# EAGLE design 05-PWR (EAGLE 9.6.2)
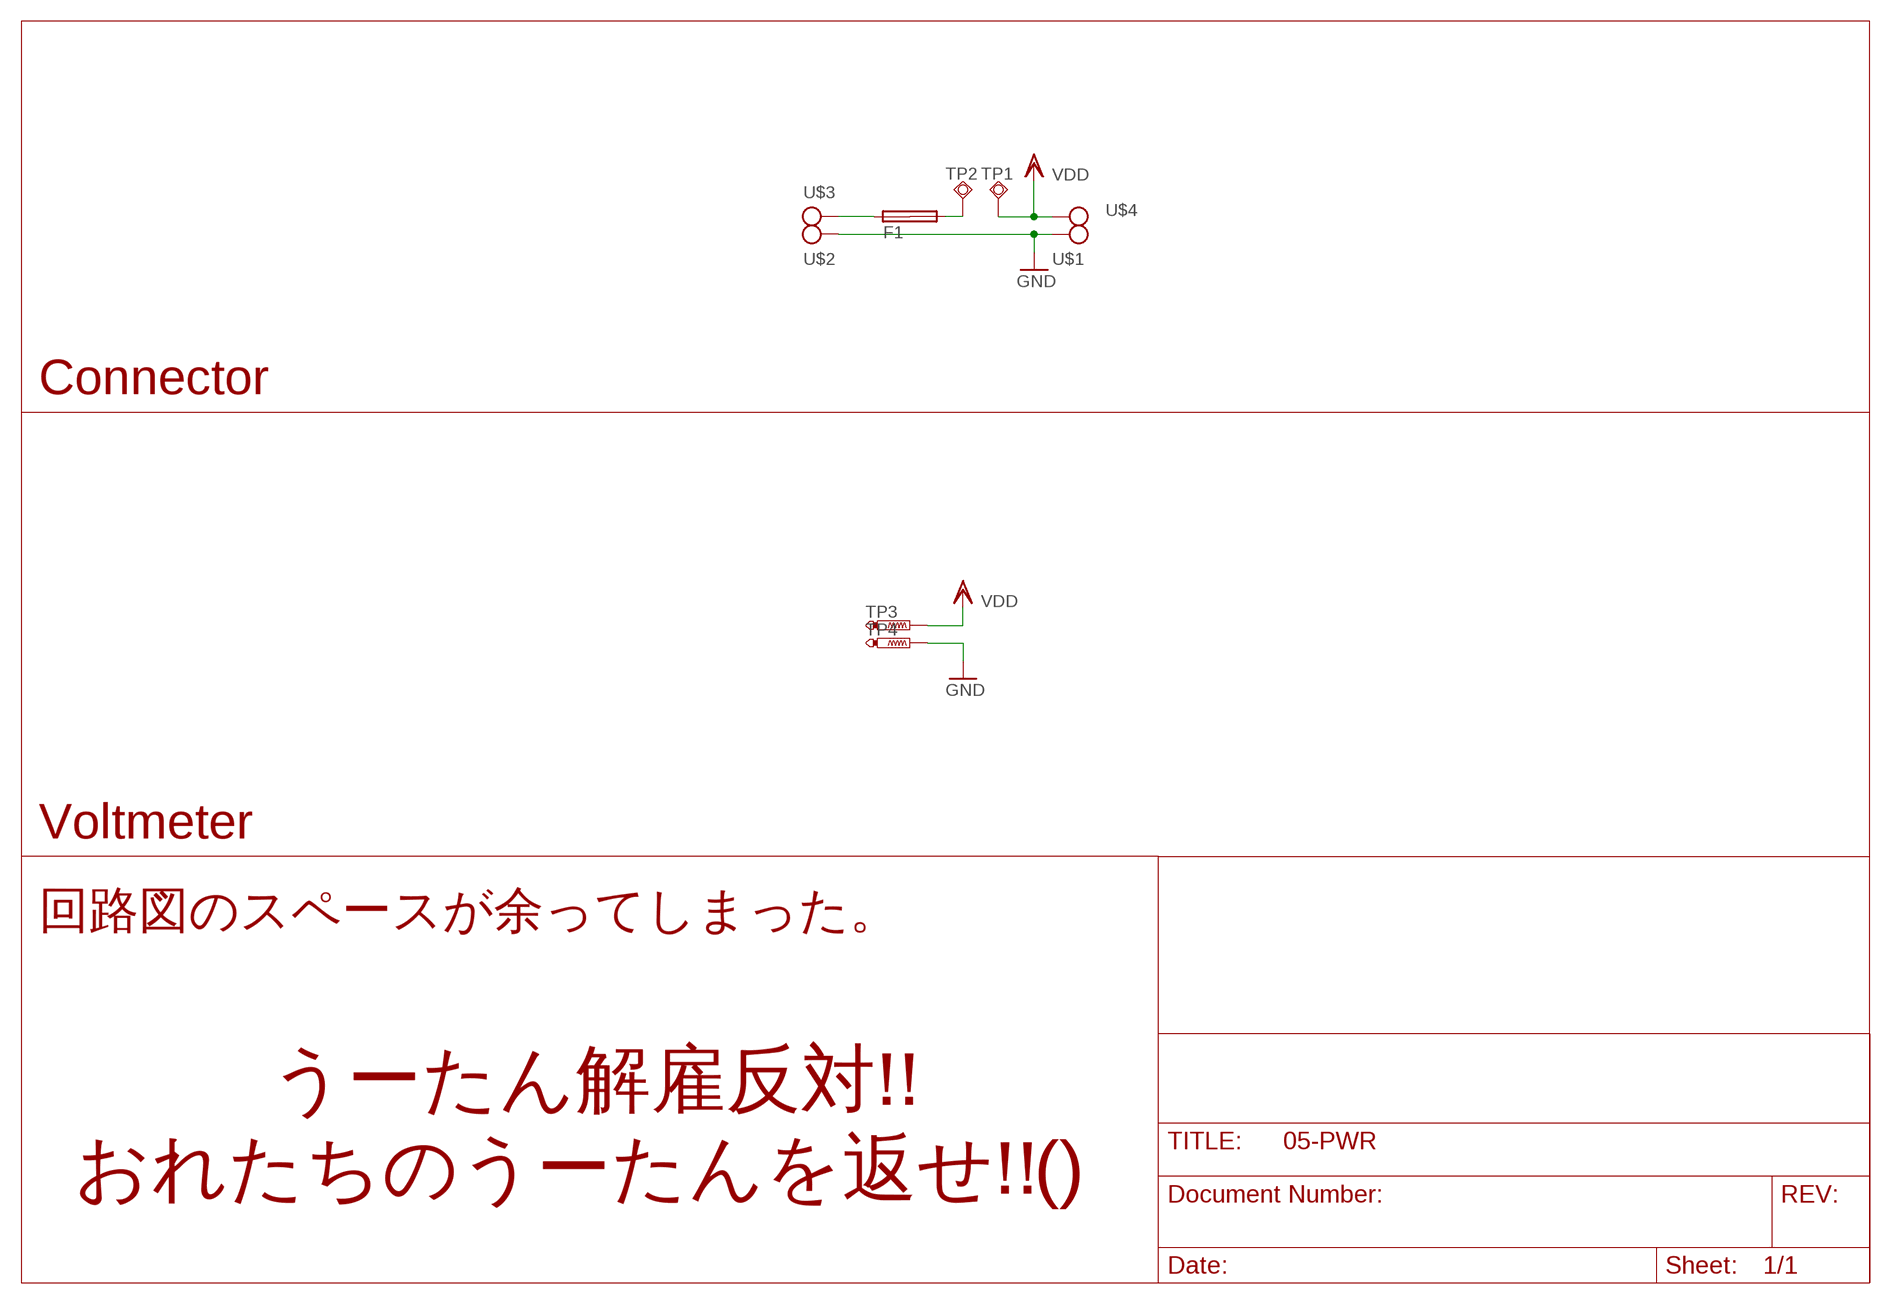
[diagram p0: schematic, sheet 1]

## Parts
F1  SHK20L  [SHK20L]
TP1  TPSQPAD1-20  [P1-20]
TP2  TPSQPAD1-20  [P1-20]
TP3  PTR1TP15R  [TP15R]
TP4  PTR1TP15SQ  [TP15SQ]
U$1  PAD_VDD  [VDD]
U$2  PAD_VDD  [VDD]
U$3  PAD_VDD  [VDD]
U$4  PAD_VDD  [VDD]

## Nets
GND: TP4.TP U$1.P$1(TP) U$2.P$1(TP)
N$2: F1.1A U$3.P$1(TP)
N$3: F1.2A TP2.TP
VDD: TP1.TP TP3.TP U$4.P$1(TP)
Unconnected: F1.1B F1.2B

## Notes on the sheet
- Connector
- Voltmeter
- 回路図のスペースが余ってしまった。
- うーたん解雇反対!!
- おれたちのうーたんを返せ!! | ()

## Library data of the parts
F1 = fuse:SHK20L: FUSE HOLDER 5 x 20 mm, SH contact, SHH1 Schukat, E1073 Buerklin; OC_FARNELL: unknown; OC_NEWARK: unknown
TP1 TP2 = testpad:TPSQ: Test pad
TP3 TP4 = testpad:PTR1: TEST PIN
U$1-U$4 = M2-CONN:PAD_VDD

## Net classes
0 default: width 0.406 mm

## Board
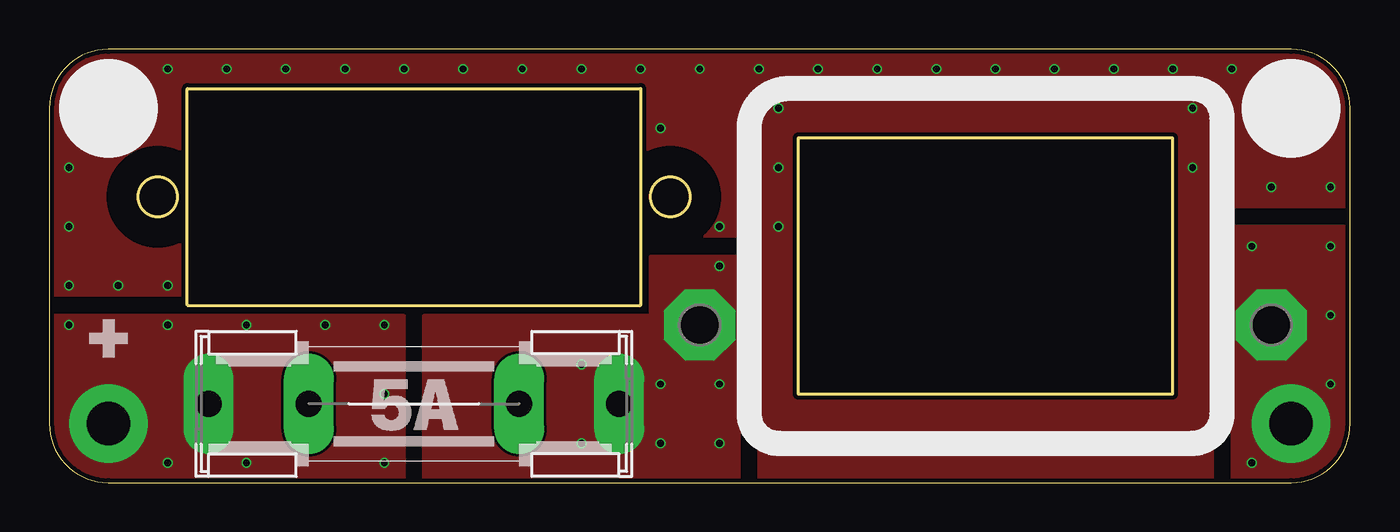
[diagram p1: board, top side]
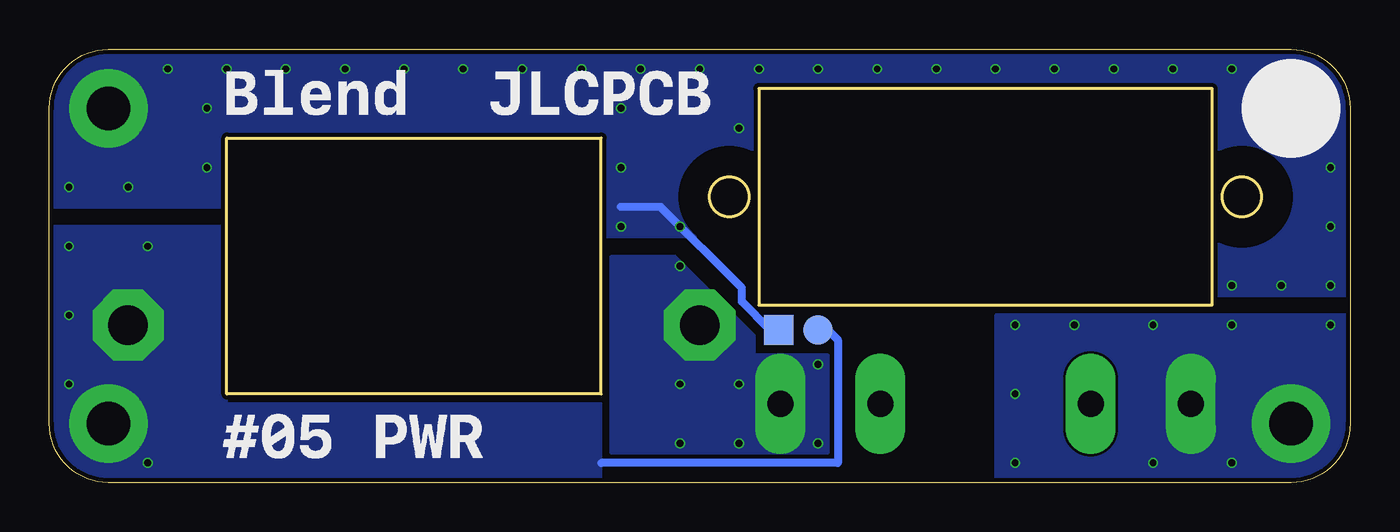
[diagram p2: board, bottom side, seen from below]

Size 66 x 22 mm. Coordinates in mm from the lower left corner, seen from the top.
Outline: 38,4.5 57,4.5 57,17.5 38,17.5 38,4.5
Outline: 7,9 30,9 30,20 7,20 7,9
Outline: 0,3 arc90 3,0 63,0 arc90 66,3 66,19 arc90 63,22 3,22 arc90 0,19 0,3
Outline: circle at 5.5,14.5 radius 1
Outline: circle at 31.5,14.5 radius 1
Copper layers (1*16): Top 0.035mm / dielectric 1.6mm / Bottom 0.035mm
Design rules "jlcpcb-2layers *": minimum track width 5mil, minimum drill 0.3mm, track to track 5mil, track to pad 5mil, pad to pad 5mil, via to via 5mil, smd to smd 5mil, copper to edge 0.2mm, drill to drill 6mil, minimum pad ring 10mil, minimum via ring 3mil, stop-mask expansion 4mil, vias tented up to drill 15mil, thermal gap 10mil
tRestrict: area 3,12 to 8,17; area 29,12 to 34,17
bRestrict: area 29,12 to 34,17; area 3,12 to 8,17

### Footprints (pad centres in the part's own frame; a part is rotated, then mirrored left to right if it is on the bottom)
SHK20L = drill 1.321 pad 2.54 long: 1A -10.414,0; 1B -5.334,0; 2A 10.414,0; 2B 5.334,0
P1-20 = drill 2.007 pad 3.15 octagon: TP 0,0
TP15R = smd 1.5 x 1.5: TP 0,0
TP15SQ = smd 1.5 x 1.5: TP 0,0
VDD = drill 2.2 pad 4: P$1 0,0

### Placement (x,y rotation side)
F1  18.5,4 0 top
TP1  62,8 0 top
TP2  33,8 0 top
TP3  27,7.75 0 bottom
TP4  29,7.75 0 bottom
U$1  3,19 0 top
U$2  63,19 0 top
U$3  3,3 0 top
U$4  63,3 0 top

### Tracks (layer width: path | path; a pad name or v marks a point on that pad's centre or on a via)
GND  (via drill 0.35)
  Bottom 0.406: TP4.TP 29.43,7.75 30.86,9.19 30.86,9.88 34.98,14 37,14
  other vias: 1,10 6,10 3.5,10 1,13 1,16 6,21 9,21 12,21 15,21 18,21 21,21 24,21 27,21 30,21 33,21 36,21 39,21 42,21 45,21 48,21 51,21 54,21 57,21 60,21 31,18 37,19 37,16 37,13 34,13 58,19 58,16 65,15 62,15
  pour Top (no thermals): 0,9.5 0,22 66,22 66,14 59,14 59,0 36,0 36,12.5 7,12.5 7,9.5
  pour Bottom (no thermals): 0,22 66,22 66,14 40,14 40,12.5 7,12.5 7,9.5 0,9.5
N$2  (via drill 0.35)
  other vias: 1,8 6,8 10,8 14,8 17,8 17,1 17,4.5 10,1 6,1
  pour Top (no thermals): 18,8.5 18,0 0,0 0,8.25 0,8.5
  pour Bottom (no thermals): 18,0 0,0 0,8.5 18,8.5
N$3  (via drill 0.35)
  other vias: 31,5 34,5 34,11 27,6 27,2 34,2 31,2
  pour Top (no thermals): 19,8.5 30.5,8.5 30.5,11.5 35,11.5 35,0 19,0
  pour Bottom (no thermals): 26.5,1.5 37.5,1.5 37.5,11.5 34.25,11.5 30.25,7.5 30.25,6.5 26.5,6.5
VDD  (via drill 0.35)
  Bottom 0.406: TP3.TP 26.5,7.75 26,7.25 26,1 38,1
  other vias: 65,5 61,1 65,12 65,8.5 61,12
  pour Bottom (no thermals): 57,13 66,13 66,0 38,0 38,4 57,4
  pour Top (no thermals): 60,13 60,0 66,0 66,13